# EAGLE design ISP Pogo Pin Adapter v1 (EAGLE 8.3.1)
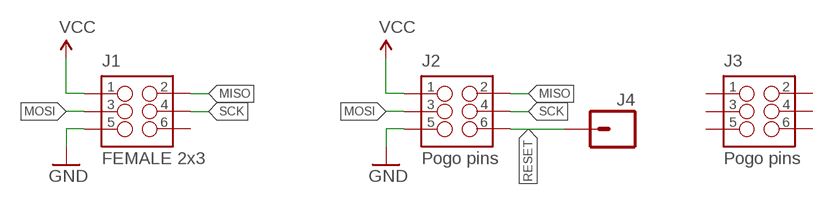
[diagram p0: schematic, sheet 1]

## Parts
J1  FEMALE 2x3  M03X2FEMALE  [2X3]
J2  Pogo pins  M03X2POGO_PINS  [2X3_POGO]
J3  Pogo pins  M03X2POGO_PINS  [2X3_POGO]
J4  M01PTH  [1X01]

## Nets
GND: J1.5 J2.P$5
MISO: J1.2 J2.P$2
MOSI: J1.3 J2.P$3
RESET: J2.P$6 J4.1
SCK: J1.4 J2.P$4
VCC: J1.1 J2.P$1
Unconnected: J1.6 J3.P$1 J3.P$2 J3.P$3 J3.P$4 J3.P$5 J3.P$6

## Library data of the parts
J1 = TimWoo-Connectors:M03X2: 2x3 .1" header. Shrouded, with keying- CONN-10681 SMT- CONN-11415 Pogo pins- HW-11044; PROD_ID: CONN-11566
J2 J3 = TimWoo-Connectors:M03X2: 2x3 .1" header. Shrouded, with keying- CONN-10681 SMT- CONN-11415 Pogo pins- HW-11044; PROD_ID: HW-11044
J4 = TimWoo-Connectors:M01: Header 1 Standard 1-pin 0.1" header. Use with straight break away headers (SKU : PRT-00116), right angle break away headers (PRT-00553), swiss pins (PRT-00743), machine pins (PRT-00117), and female headers (PRT-00115). SMTSO-256-ET is a "flush mount" nut for a 4-40 screw. The older package used to be too tight, and did not allow it to sit properly thru the drill hit. The latest (0.165DIA) fits nice and snug.

## Board
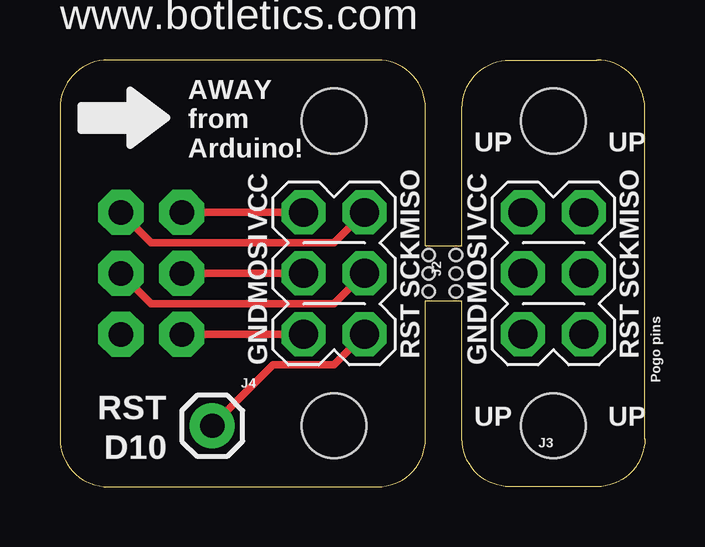
[diagram p1: board, top side]
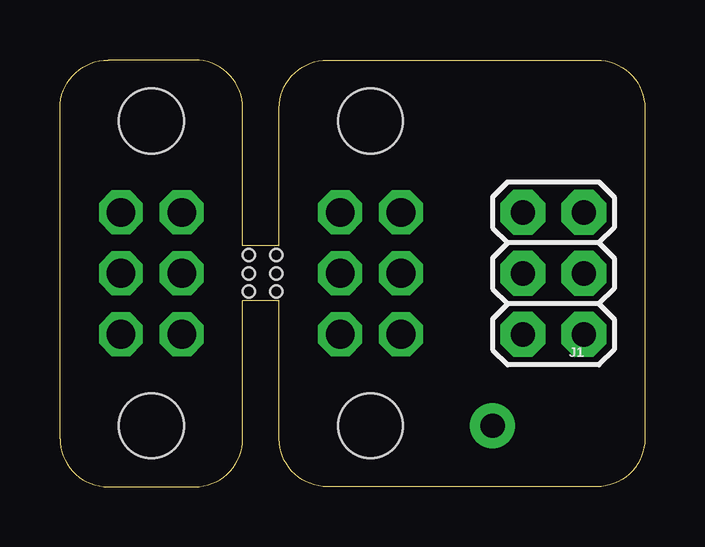
[diagram p2: board, bottom side, seen from below]

Size 24.38 x 17.78 mm. Coordinates in mm from the lower left corner, seen from the top.
Outline: 0,15.78 0,2 arc90 2,0 13.24,0 arc90 15.24,2 15.24,7.75 16.76,7.75 16.76,2 arc90 18.76,0 22.38,0 arc90 24.38,2 24.38,15.78 arc90 22.38,17.78 18.76,17.78 arc90 16.76,15.78 16.76,10.03 15.24,10.03 15.24,15.78 arc90 13.24,17.78 2,17.78 arc90 0,15.78
Copper layers (1*16): Top 0.0356mm / dielectric 1.5011mm / Bottom 0.0356mm
Design rules "oshpark-2layer *": minimum track width 6mil, minimum drill 13mil, track to track 6mil, track to pad 6mil, pad to pad 6mil, via to via 6mil, smd to smd 6mil, copper to edge 15mil, drill to drill 6mil, minimum pad ring 7mil, minimum via ring 7mil, stop-mask expansion 2.5mil, vias tented up to drill 0mil, thermal gap 10mil
Holes 2.7 mm at 11.43,2.54 11.43,15.24 20.57,15.24 20.57,2.54
Holes 0.51 mm at 16.51,9.65 16.51,8.89 16.51,8.13 15.37,9.65 15.37,8.89 15.37,8.13

### Footprints (pad centres in the part's own frame; a part is rotated, then mirrored left to right if it is on the bottom)
2X3 = drill 1.016 pad 1.88 octagon: 1 -2.54,-1.27; 2 -2.54,1.27; 3 0,-1.27; 4 0,1.27; 5 2.54,-1.27; 6 2.54,1.27
2X3_POGO = drill 1.2 pad 1.829 octagon: P$1 -2.54,-1.27; P$2 -2.54,1.27; P$3 0,-1.27; P$4 0,1.27; P$5 2.54,-1.27; P$6 2.54,1.27
1X01 = drill 1.016 pad 1.88: 1 0,0

### Placement (x,y rotation side)
J1  3.81,8.89 270 bottom
J2  11.43,8.89 270 top
J3  20.57,8.89 270 top
J4  6.35,2.54 0 top

### Tracks (layer width: path | path; a pad name or v marks a point on that pad's centre or on a via)
GND
  Top 0.305: J1.5 J2.P$5
MISO
  Top 0.305: J1.2 3.81,10.16 11.43,10.16 J2.P$2
MOSI
  Top 0.305: J1.3 J2.P$3
RESET
  Top 0.305: J4.1 8.89,5.08 11.43,5.08 J2.P$6
SCK
  Top 0.305: J1.4 3.81,7.62 11.43,7.62 J2.P$4
VCC
  Top 0.305: J1.1 J2.P$1

### Text on the board
tPlace: Created by Timothy Woo | www.botletics.com | AWAY / from / Arduino! | UP | UP | VCC | VCC | MISO | MISO | MOSI | SCK | MOSI | SCK | GND | RST | GND | RST | RST | UP | UP | D10